# Altium schematic sheet beaglebone_black.SchDoc
size A4
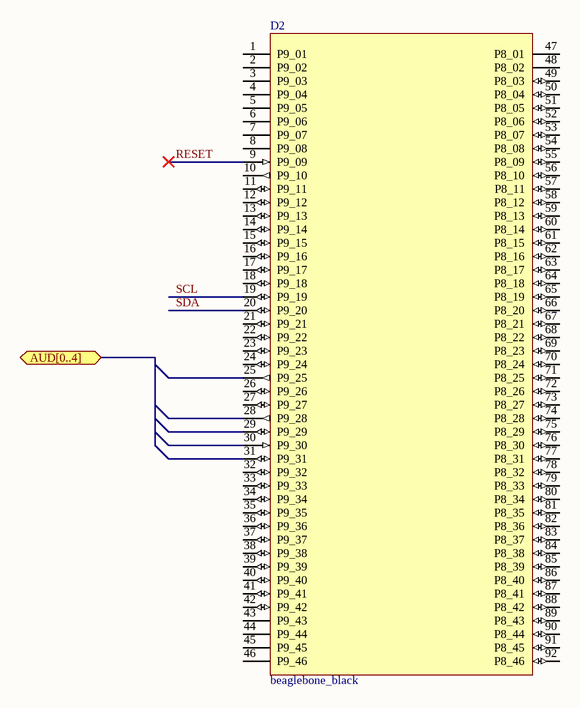
[diagram p0: beaglebone_black.SchDoc]

## Parts
D2  beaglebone_black  [BBB_Cape]

## Ports
AUD[0..4] (bidir)

## Nets
RESET: D2.9(P9_09)
SCL: D2.19(P9_19)
SDA: D2.20(P9_20)

Not connected (* = marked no-connect by the designer): D2 1(P9_01) 2(P9_02) 3(P9_03) 4(P9_04) 5(P9_05) 6(P9_06) 7(P9_07) 8(P9_08) 10(P9_10) 11(P9_11) 12(P9_12) 13(P9_13) 14(P9_14) 15(P9_15) 16(P9_16) 17(P9_17) 18(P9_18) 21(P9_21) 22(P9_22) 23(P9_23) 24(P9_24) 25(P9_25) 26(P9_26) 27(P9_27) 28(P9_28) 29(P9_29) 30(P9_30) 31(P9_31) 32(P9_32) 33(P9_33) 34(P9_34) 35(P9_35) 36(P9_36) 37(P9_37) 38(P9_38) 39(P9_39) 40(P9_40) 41(P9_41) 42(P9_42) 43(P9_43) 44(P9_44) 45(P9_45) 46(P9_46) 47(P8_01) 48(P8_02) 49(P8_03) 50(P8_04) 51(P8_05) 52(P8_06) 53(P8_07) 54(P8_08) 55(P8_09) 56(P8_10) 57(P8_11) 58(P8_12) 59(P8_13) 60(P8_14) 61(P8_15) 62(P8_16) 63(P8_17) 64(P8_18) 65(P8_19) 66(P8_20) 67(P8_21) 68(P8_22) 69(P8_23) 70(P8_24) 71(P8_25) 72(P8_26) 73(P8_27) 74(P8_28) 75(P8_29) 76(P8_30) 77(P8_31) 78(P8_32) 79(P8_33) 80(P8_34) 81(P8_35) 82(P8_36) 83(P8_37) 84(P8_38) 85(P8_39) 86(P8_40) 87(P8_41) 88(P8_42) 89(P8_43) 90(P8_44) 91(P8_45) 92(P8_46)